# EAGLE design antenna_adapter (EAGLE 8.6.2)
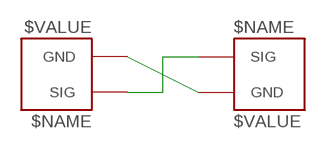
[diagram p0: schematic, sheet 1]

## Parts
U$1  CONN_MCX  [MCX_JACK_FEMALE_SMD]
U$2  CONN_UMC  [UMC_JACK_MALE_SMD]

## Nets
GND: U$1.GND@1(GND) U$1.GND@2(GND) U$1.GND@3(GND) U$1.GND@4(GND) U$2.GND@1(GND) U$2.GND@2(GND) U$2.GND@3(GND)
SIG: U$1.SIG U$2.SIG

## Library data of the parts
U$1 = DubSat1 Components:CONN_MCX
U$2 = DubSat1 Components:CONN_UMC

## Board
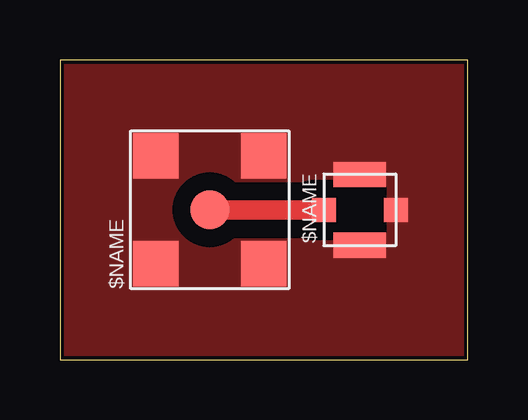
[diagram p1: board, top side]

Size 17 x 12.5 mm. Coordinates in mm from the lower left corner, seen from the top.
Outline: 0,0 17,0 17,12.5 0,12.5 0,0
Copper layers (1*16): Top 0.035mm / dielectric 1.5mm / Bottom 0.035mm
Design rules "default *": minimum track width 6mil, minimum drill 0.35mm, track to track 30mil, track to pad 30mil, pad to pad 30mil, via to via 30mil, smd to smd 14mil, copper to edge 6mil, drill to drill 6mil, minimum pad ring 10mil, minimum via ring 8mil, stop-mask expansion 4mil, vias tented up to drill 0mil, thermal gap 6mil

### Footprints (pad centres in the part's own frame; a part is rotated, then mirrored left to right if it is on the bottom)
MCX_JACK_FEMALE_SMD = smd 1.9 x 1.9: GND@1 -2.25,2.25; GND@2 2.25,2.25; GND@3 -2.25,-2.25; GND@4 2.25,-2.25 | smd 1.6 x 1.6: SIG 0,0
UMC_JACK_MALE_SMD = smd 1.05 x 2.2: GND@1 -1.475,0; GND@2 1.475,0 | smd 1 x 1: GND@3 0,1.5; SIG 0,-1.5

### Placement (x,y rotation side)
U$1  6.25,6.25 0 top
U$2  12.5,6.25 270 top

### Tracks (layer width: path | path; a pad name or v marks a point on that pad's centre or on a via)
GND
  pour Top (no thermals): 0,12.5 17,12.5 17,0 0,0
SIG
  Top 0.813: U$1.SIG U$2.SIG